# Altium schematic sheet VI Sensors.SchDoc
size A4; SheetNumber: 12; SheetTotal: 13
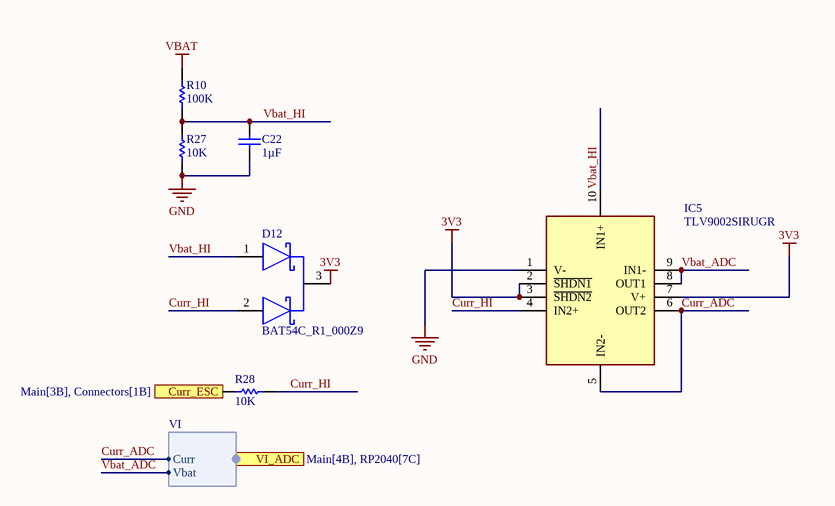
[diagram p0: VI Sensors.SchDoc]

## Parts
C22  1µF  [0402 cap]
D12  BAT54C_R1_000Z9  [FP-SOT23-MFG]
IC5  TLV9002SIRUGR  [QFN50P150X200X40-10N]
R10  100K  [0402 resistor]
R27  10K  [0402 resistor]
R28  10K  [0402 resistor]

## Ports
Curr_ESC (see Main[3B], Connectors[1B]), VI_ADC (harness VI, see Main[4B], RP2040[7C])

## Harnesses
VI: Curr, Vbat

## Nets
3V3: D12.3(COMMON_CATHODE) IC5.2(~{SHDN1}) IC5.3(~{SHDN2}) IC5.7(V+)
GND: C22.1 IC5.1(V-) R27.1
VBAT: R10.2
Curr_ADC: IC5.5(IN2-) IC5.6(OUT2) ; port VI_ADC.Curr
Curr_ESC: R28.2 ; port Curr_ESC
Curr_HI: D12.2(2_ANODE) IC5.4(IN2+) R28.1
Vbat_ADC: IC5.8(OUT1) IC5.9(IN1-) ; port VI_ADC.Vbat
Vbat_HI: C22.2 D12.1(1_ANODE) IC5.10(IN1+) R10.1 R27.2

## Library data of the parts
C22 = Capacitor 0402 100nF: Value: 1µF
D12 = CMP-14398-000007-1: DIODE ARRAY SCHOTTKY 30V SOT23; Manufacturer: Nexperia; Manufacturer Part Number: BAT54C,215; Automotive Grade: Grade 0; Peak Reverse Current: 2uA; Forward Current: 200mA; Max Surge Forward Current: 600mA; Value: 10pF; Max Junction Temp: +150°C; Lead Free: Yes; Automotive: Yes; Device Class L1: Discrete Semiconductors; Digikey Description: DIODE ARRAY SCHOTTKY 30V SOT23; Reverse Voltage: 30V; ComponentLink2URL: https://assets.nexperia.com/documents/data-sheet/BAT54_SER.pdf; Device Class L2: Diodes; Category: Diode; Octopart: https://octopart.com/bat54c%2C215-nexperia-78738945; Package: SOT23; Mouser Description: Schottky Diodes, Rectifiers - Arrays SOT-23 (TO-236AB) 30V 200mA (DC) Surface Mount; RoHS: TRUE; Temperature: to +150°C; Ambient Temperature Range Low: -55°C; Height: 1.1mm; Device Class L3: Schottky Diodes; Temperature Range High: +150°C; Footprint Url: https://assets.nexperia.com/documents/outline-drawing/SOT23.pdf; Capacitance: 10pF; Ambient Temperature Range High: +150°C; Ipc Land Pattern Name: SOT95P230X100-3; ComponentLink2Description: Datasheet
IC5 = TLV9002SIRUGR: Integrated Circuit; Manufacturer_Name: Texas Instruments; Datasheet Link: http://www.ti.com/lit/gpn/TLV9002; Height: 0.4mm; Manufacturer_Part_Number: TLV9002SIRUGR; Mouser Part Number: 595-TLV9002SIRUGR; Mouser Price/Stock: https://www.mouser.co.uk/ProductDetail/Texas-Instruments/TLV9002SIRUGR?qs=2WXlatMagcFgZnU86g5SIg%3D%3D; Arrow Part Number: TLV9002SIRUGR; Arrow Price/Stock: https://www.arrow.com/en/products/tlv9002sirugr/texas-instruments?region=nac
R10 R27 R28 = Resistor 0402 1K
  R10: Value: 100K
  R27 R28: Value: 10K